# Altium schematic sheet TI_ADC_VOLTAGE.SchDoc
size 500 x 500 mm
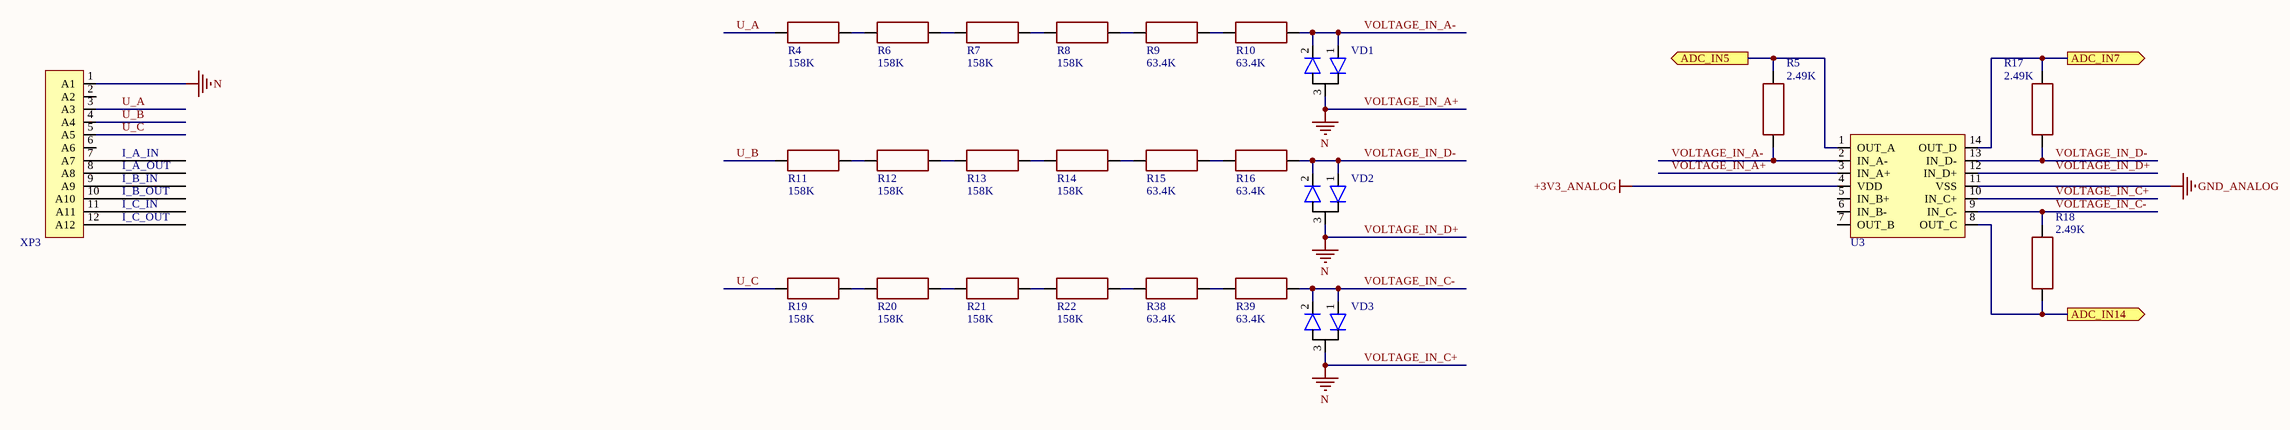
[diagram p0: TI_ADC_VOLTAGE.SchDoc]

## Parts
R4  value 158K  [RES: 0603]  (hidden comment: Resistor_0603)
R5  value 2.49K  [RES: 0603]  (hidden comment: Resistor_0603)
R6  value 158K  [RES: 0603]  (hidden comment: Resistor_0603)
R7  value 158K  [RES: 0603]  (hidden comment: Resistor_0603)
R8  value 158K  [RES: 0603]  (hidden comment: Resistor_0603)
R9  value 63.4K  [RES: 0603]  (hidden comment: Resistor_0603)
R10  value 63.4K  [RES: 0603]  (hidden comment: Resistor_0603)
R11  value 158K  [RES: 0603]  (hidden comment: Resistor_0603)
R12  value 158K  [RES: 0603]  (hidden comment: Resistor_0603)
R13  value 158K  [RES: 0603]  (hidden comment: Resistor_0603)
R14  value 158K  [RES: 0603]  (hidden comment: Resistor_0603)
R15  value 63.4K  [RES: 0603]  (hidden comment: Resistor_0603)
R16  value 63.4K  [RES: 0603]  (hidden comment: Resistor_0603)
R17  value 2.49K  [RES: 0603]  (hidden comment: Resistor_0603)
R18  value 2.49K  [RES: 0603]  (hidden comment: Resistor_0603)
R19  value 158K  [RES: 0603]  (hidden comment: Resistor_0603)
R20  value 158K  [RES: 0603]  (hidden comment: Resistor_0603)
R21  value 158K  [RES: 0603]  (hidden comment: Resistor_0603)
R22  value 158K  [RES: 0603]  (hidden comment: Resistor_0603)
R38  value 63.4K  [RES: 0603]  (hidden comment: Resistor_0603)
R39  value 63.4K  [RES: 0603]  (hidden comment: Resistor_0603)
U3  MCP6004  [SOIC-14]  (value not drawn)
VD1  BAV99  [SOT-23-3]  (value not drawn)
VD2  BAV99  [SOT-23-3]  (value not drawn)
VD3  BAV99  [SOT-23-3]  (value not drawn)
XP3  PLS-6 (DS1MSTB 2,5/12-GF-5,08021-1x6)  [MSTB 2,5/12-GF-5,08]  (value not drawn)

## Ports
ADC_IN5 (out), ADC_IN7 (out), ADC_IN14 (out)

## Nets
+3V3_ANALOG: U3.4(VDD)
GND_ANALOG: U3.11(VSS)
VOLTAGE_IN_A+: U3.3(IN_A+) U3.10(IN_C+) U3.12(IN_D+) VD1.3 VD2.3 VD3.3 XP3.1(A1)  [also labelled N, VOLTAGE_IN_C+, VOLTAGE_IN_D+]
ADC_IN5: R5.2 U3.1(OUT_A) ; port ADC_IN5
ADC_IN7: R17.2 U3.14(OUT_D) ; port ADC_IN7
ADC_IN14: R18.1 U3.8(OUT_C) ; port ADC_IN14
U_A: R4.1 XP3.3(A3)
U_B: R11.1 XP3.4(A4)
U_C: R19.1 XP3.5(A5)
VOLTAGE_IN_A-: R5.1 R10.2 U3.2(IN_A-) VD1.1 VD1.2
VOLTAGE_IN_C-: R18.2 R39.2 U3.9(IN_C-) VD3.1 VD3.2
VOLTAGE_IN_D-: R16.2 R17.1 U3.13(IN_D-) VD2.1 VD2.2
NetR4_2: R4.2 R6.1
NetR6_2: R6.2 R7.1
NetR7_2: R7.2 R8.1
NetR8_2: R8.2 R9.1
NetR9_2: R9.2 R10.1
NetR11_2: R11.2 R12.1
NetR12_2: R12.2 R13.1
NetR13_2: R13.2 R14.1
NetR14_2: R14.2 R15.1
NetR15_2: R15.2 R16.1
NetR19_2: R19.2 R20.1
NetR20_2: R20.2 R21.1
NetR21_2: R21.2 R22.1
NetR22_2: R22.2 R38.1
NetR38_2: R38.2 R39.1

Not connected (* = marked no-connect by the designer): U3 5(IN_B+) 6(IN_B-) 7(OUT_B); XP3 2(A2) 6(A6) 7(A7) 8(A8) 9(A9) 10(A10) 11(A11) 12(A12)

## Notes on the sheet
- (near XP3) I_A_IN
- (near XP3) I_A_OUT
- (near XP3) I_B_IN
- (near XP3) I_B_OUT
- (near XP3) I_C_IN
- (near XP3) I_C_OUT

## Library data of the parts
R4-R22 R38 R39 = Resistor_0603: Power: 0.1W; Tolerance: ±5%; Package/Case: 0603; Temperature: -55...+125°C; Product Category: Resistors
U3 = MCP6004: 1 MHz, Low-Power Op Amp; Manufacturer: Microchip; Datasheet: https://eu.mouser.com/ProductDetail/Microchip-Technology-Atmel/MCP6004-I-SL?qs=n%2FfJlMG9rCZ2%2F%2FCryvZ52w%3D%3D; HelpURL: https://eu.mouser.com/ProductDetail/Microchip-Technology-Atmel/MCP6004-I-SL?qs=n%2FfJlMG9rCZ2%2F%2FCryvZ52w%3D%3D; Package/Case: SOIC-14; Product Category: Operational Amplifiers
VD1-VD3 = BAV99: High-speed switching diode; Manufacturer: Nexperia; Datasheet: https://eu.mouser.com/datasheet/2/916/BAV99_SER-1370693.pdf; HelpURL: https://eu.mouser.com/ProductDetail/Nexperia/BAV99235?qs=me8TqzrmIYWUP4h8SbZlfQ%3D%3D; Package/Case: SOT-23; Product Category: Diodes
XP3 = MSTB 2,5/12-GF-5,08: Surface Mount, Single row, 12 Positions, 5.08mm; Manufacturer: Phoenix contact; Datasheet: https://www.phoenixcontact.com/ru-pc/produkty/korpusnaa-cast-dla-pecatnyh-plat-mstb-25-12-gf-508-1776605; HelpURL: https://www.phoenixcontact.com/ru-pc/produkty/korpusnaa-cast-dla-pecatnyh-plat-mstb-25-12-gf-508-1776605; Product Category: Connectors